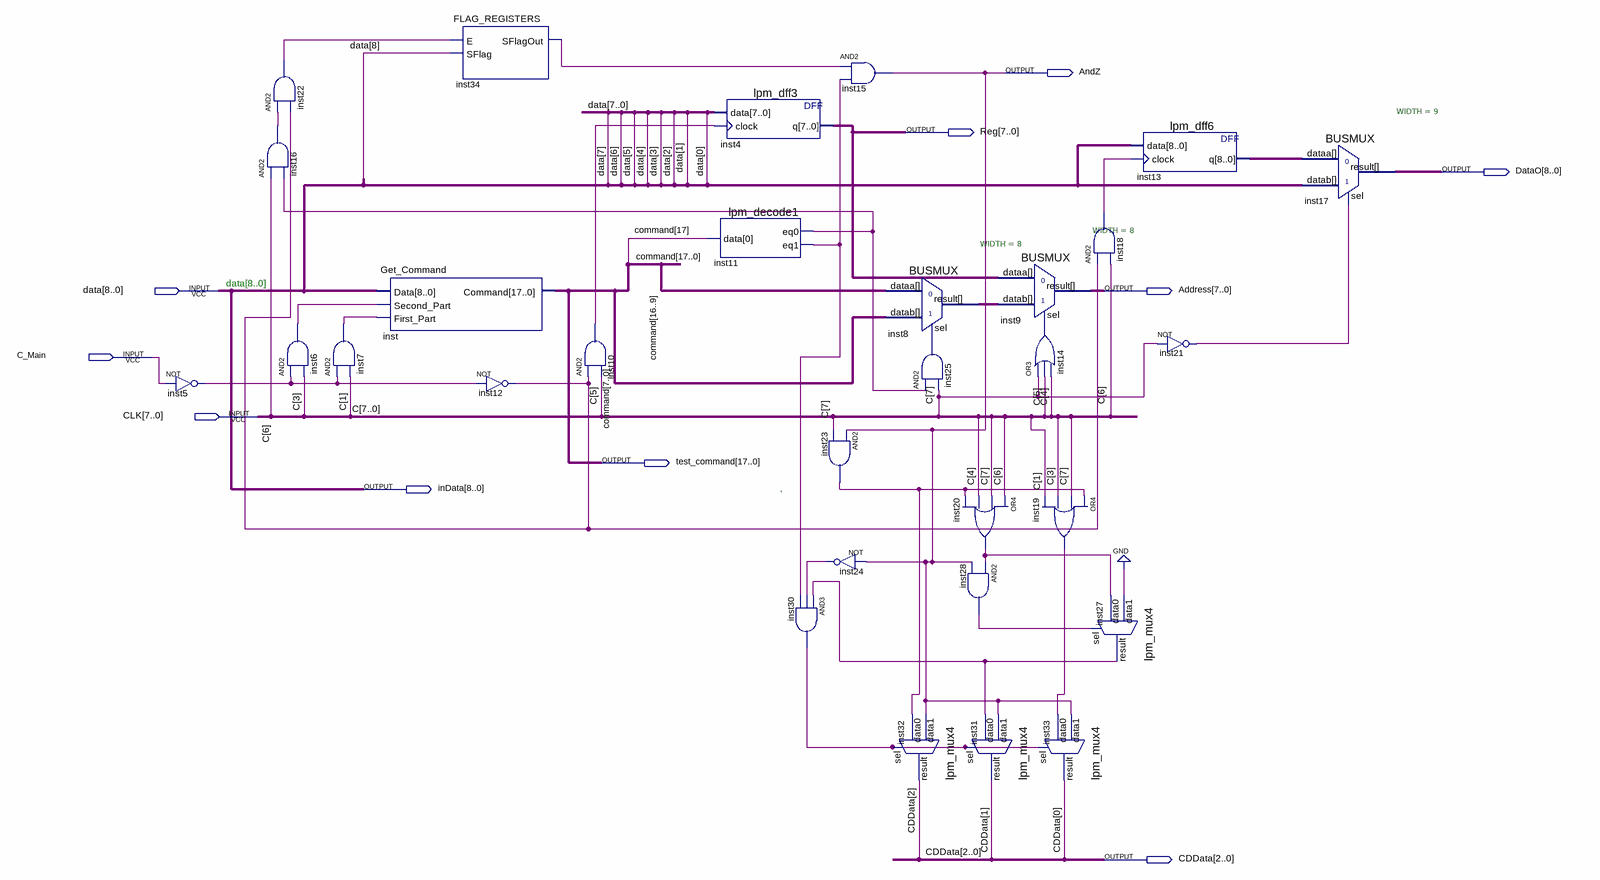
[diagram p0: schematic sheet]
// Quartus schematic CONTROL_DEVICE.bdf as structural Verilog: 30 symbols, 10 pins
module CONTROL_DEVICE (
  input  [8:0] data,
  input  C_Main,
  input  [7:0] CLK,
  output AndZ,
  output [7:0] Reg,
  output [8:0] DataO,
  output [7:0] Address,
  output [17:0] test_command,
  output [8:0] inData,
  output [2:0] CDData
);

  wire inst5_out, inst6_out, inst7_out, inst10_out, inst11_eq0, inst11_eq1, inst12_out, inst14_out,
       inst16_out, inst18_out, inst19_out, inst20_out, inst21_out, inst22_out, inst23_out, inst24_out,
       inst25_out, inst27_result, inst28_out, inst30_out, inst34_sflagout;
  wire [7:0] inst8_result;
  wire [8:0] inst13_q;

  not inst5 (inst5_out, C_Main);
  and inst16 (inst16_out, CLK[6], inst11_eq0);
  and inst22 (inst22_out, inst16_out, inst12_out);
  and inst6 (inst6_out, inst5_out, CLK[3]);
  and inst7 (inst7_out, inst5_out, CLK[1]);
  Get_Command inst (.Data(data), .Second_Part(inst6_out), .First_Part(inst7_out), .Command(test_command));
  FLAG_REGISTERS inst34 (.E(inst22_out), .SFlag(data[8]), .SFlagOut(inst34_sflagout));
  not inst12 (inst12_out, inst5_out);
  and inst10 (inst10_out, inst12_out, CLK[5]);
  lpm_dff3 inst4 (.data(data[7:0]), .clock(inst10_out), .q(Reg));
  lpm_decode1 inst11 (.data(test_command[17]), .eq0(inst11_eq0), .eq1(inst11_eq1));
  and inst30 (inst30_out, inst27_result, inst24_out, inst11_eq1);
  and inst15 (AndZ, inst34_sflagout, inst11_eq1);
  and inst23 (inst23_out, AndZ, CLK[7]);
  not inst24 (inst24_out, AndZ);
  BUSMUX #(.WIDTH(8)) inst8 (
    .datab(test_command[7:0]), .sel(inst25_out), .dataa(test_command[16:9]), .result(inst8_result));
  lpm_mux4 inst32 (.data1(AndZ), .data0(inst23_out), .sel(inst30_out), .result(CDData[2]));
  and inst25 (inst25_out, inst11_eq0, CLK[7]);
  BUSMUX #(.WIDTH(8)) inst9 (.datab(inst8_result), .sel(inst14_out), .dataa(Reg), .result(Address));
  or inst20 (inst20_out, CLK[6], CLK[7], CLK[4], inst23_out);
  and inst28 (inst28_out, inst20_out, AndZ);
  lpm_mux4 inst31 (.data1(AndZ), .data0(inst27_result), .sel(inst30_out), .result(CDData[1]));
  or inst14 (inst14_out, CLK[7], CLK[5], CLK[4]);
  or inst19 (inst19_out, inst23_out, CLK[7], CLK[3], CLK[1]);
  lpm_mux4 inst33 (.data1(AndZ), .data0(inst19_out), .sel(inst30_out), .result(CDData[0]));
  and inst18 (inst18_out, inst12_out, CLK[6]);
  lpm_mux4 inst27 (.data1(1'b0), .data0(inst20_out), .sel(inst28_out), .result(inst27_result));
  lpm_dff6 inst13 (.data(data), .clock(inst18_out), .q(inst13_q));
  not inst21 (inst21_out, CLK[7]);
  BUSMUX #(.WIDTH(9)) inst17 (.datab(data), .sel(inst21_out), .dataa(inst13_q), .result(DataO));

  assign inData = data;

  // Other names for the same wires on the sheet: C[7:0] = CLK; command[17:0] = test_command

  // Notes on the sheet:
  //   ,
endmodule
